# EAGLE schematic CAN2matrix (EAGLE 6.1)
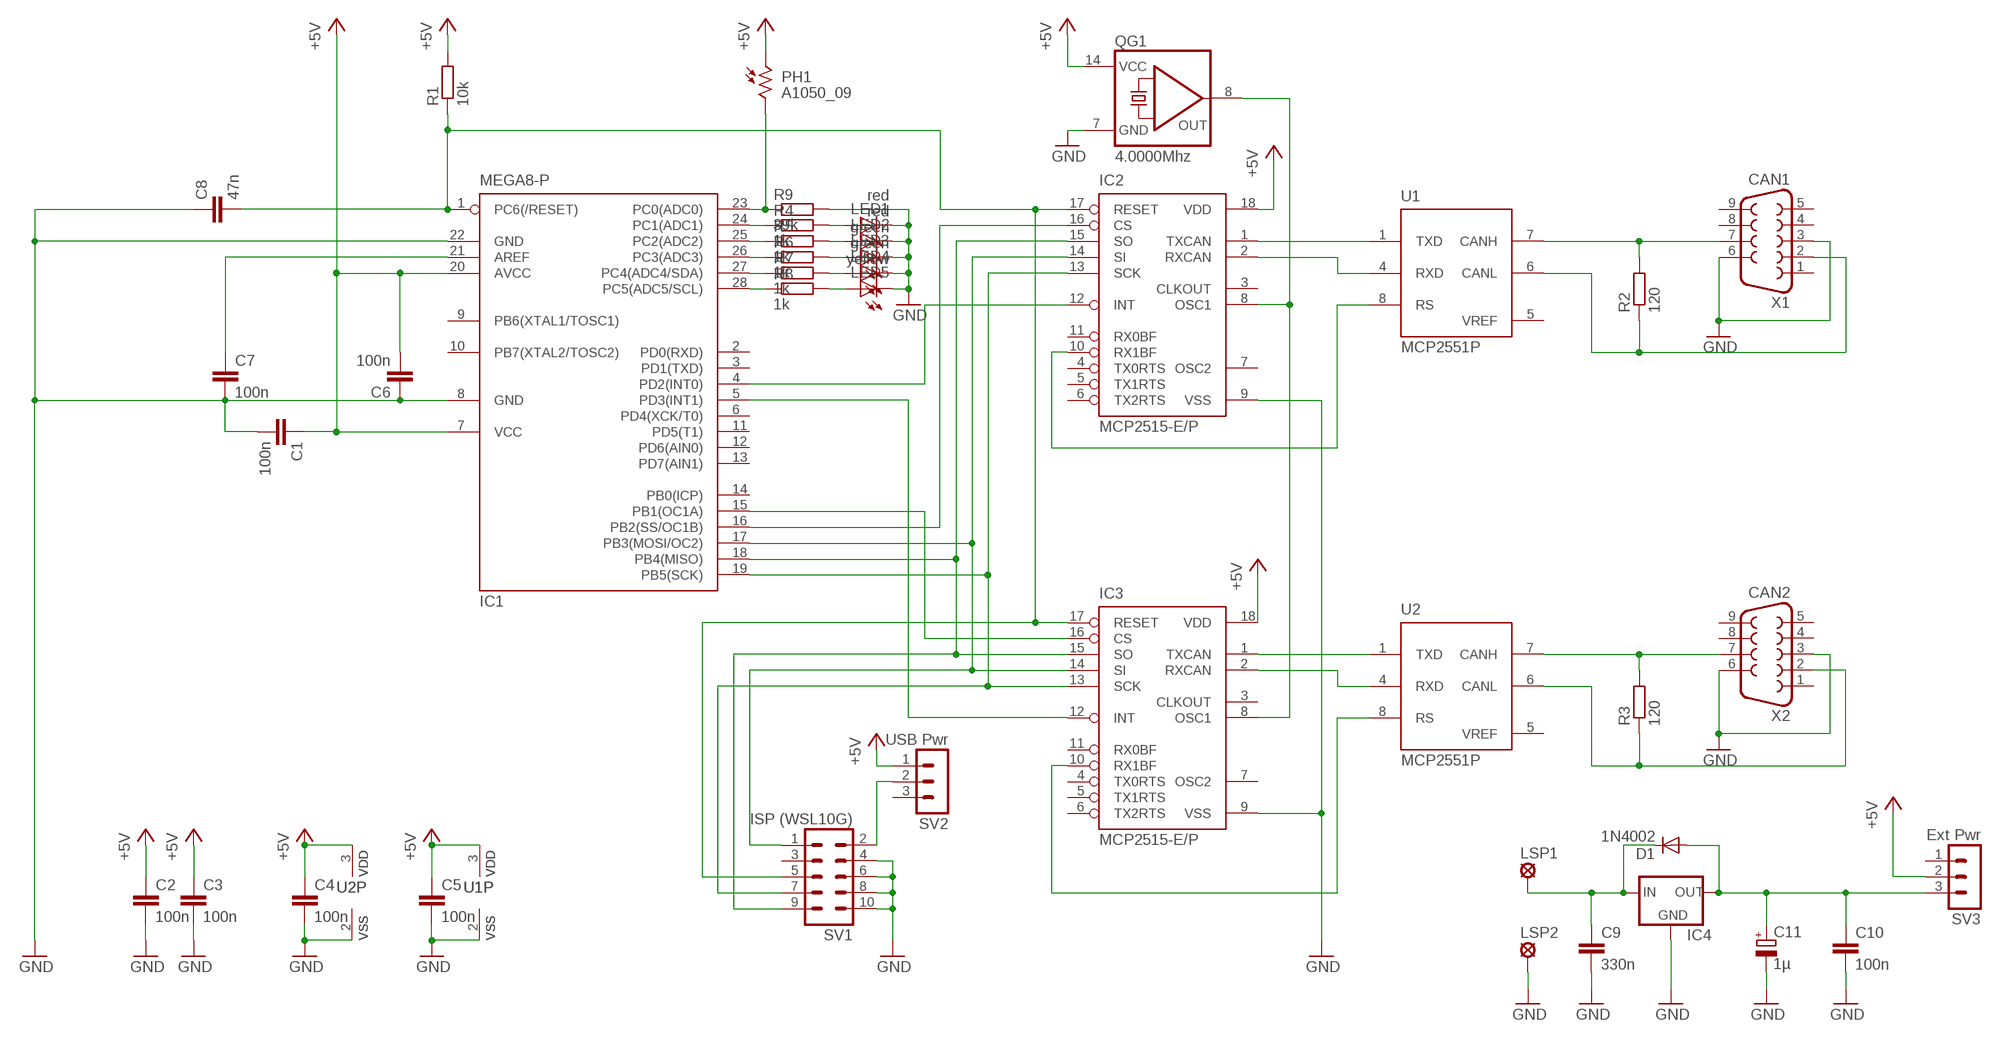
[diagram p0: schematic, sheet 1]

## Parts
C1  100n  C-EU050-025X075  [C050-025X075]
C2  100n  C-EU050-025X075  [C050-025X075]
C3  100n  C-EU050-025X075  [C050-025X075]
C4  100n  C-EU050-025X075  [C050-025X075]
C5  100n  C-EU050-025X075  [C050-025X075]
C6  100n  C-EU050-025X075  [C050-025X075]
C7  100n  C-EU050-025X075  [C050-025X075]
C8  47n  C-EU050-025X075  [C050-025X075]
C9  330n  C-EU050-025X075  [C050-025X075]
C10  100n  C-EU050-025X075  [C050-025X075]
C11  1µ  CPOL-EUE2.5-7  [E2,5-7]
D1  1N4002  1N4004  [DO41-10]
IC1  MEGA8-P  [DIL28-3]
IC2  MCP2515-E/P  [DIL18]
IC3  MCP2515-E/P  [DIL18]
IC4  78LXX  [78LXX]
LED1  red  LED3MM  [LED3MM]
LED2  red  LED3MM  [LED3MM]
LED3  green  LED3MM  [LED3MM]
LED4  green  LED3MM  [LED3MM]
LED5  yellow  LED3MM  [LED3MM]
LSP1  +12V  SE14  [SE14]
LSP2  SE14  [SE14]
PH1  A1050_09  [T0-46-A10XX]
QG1  4.0000Mhz  QG5860  [DIL14S]
R1  10k  R-EU_0207/2V  [0207/2V]
R2  120  R-EU_0207/2V  [0207/2V]
R3  120  R-EU_0207/2V  [0207/2V]
R4  1k  R-EU_0207/10  [0207/10]
R5  1k  R-EU_0207/10  [0207/10]
R6  1k  R-EU_0207/10  [0207/10]
R7  1k  R-EU_0207/10  [0207/10]
R8  1k  R-EU_0207/10  [0207/10]
R9  39k  R-EU_0204/7  [0204/7]
SV1  ISP (WSL10G)  ML10  [ML10]
SV2  USB Pwr  MA03-1  [MA03-1]
SV3  Ext Pwr  MA03-1  [MA03-1]
U1  MCP2551P  [DIL8]
U2  MCP2551P  [DIL8]
X1  CAN1  F09HP  [F09HP]
X2  CAN2  F09HP  [F09HP]

## Nets
+5V: C1.1 C2.1 C3.1 C4.1 C5.1 C6.2 IC1.7(VCC) IC1.20(AVCC) IC2.18(VDD) IC3.18(VDD) PH1.1 QG1.14(VCC) R1.2 SV2.1 SV3.2 U1.3(VDD) U2.3(VDD)
+12V: C9.1 D1.C IC4.IN LSP1.MP
GND: C1.2 C2.2 C3.2 C4.2 C5.2 C6.1 C7.2 C8.1 C9.2 C10.2 C11.- IC1.8(GND) IC1.22(GND) IC2.9(VSS) IC3.9(VSS) IC4.GND LED1.K(C) LED2.K(C) LED3.K(C) LED4.K(C) LED5.K(C) LSP2.MP QG1.7(GND) R9.2 SV1.4 SV1.6 SV1.8 SV1.10 U1.2(VSS) U2.2(VSS) X1.3 X1.6 X2.3 X2.6
N$1: IC1.18(PB4(MISO)) IC2.15(SO) IC3.15(SO) SV1.9
N$2: IC1.17(PB3(MOSI/OC2)) IC2.14(SI) IC3.14(SI) SV1.1
N$3: IC1.19(PB5(SCK)) IC2.13(SCK) IC3.13(SCK) SV1.7
N$4: R2.2 U1.7(CANH) X1.7
N$5: R3.2 U2.7(CANH) X2.7
N$6: R3.1 U2.6(CANL) X2.2
N$7: IC3.10(RX1BF) U2.8(RS)
N$8: C7.1 IC1.21(AREF)
N$9: C8.2 IC1.1(PC6(/RESET)) IC2.17(RESET) IC3.17(RESET) R1.1 SV1.5
N$10: IC2.1(TXCAN) U1.1(TXD)
N$11: IC2.2(RXCAN) U1.4(RXD)
N$12: IC3.1(TXCAN) U2.1(TXD)
N$13: IC3.2(RXCAN) U2.4(RXD)
N$14: IC1.16(PB2(SS/OC1B)) IC2.16(CS)
N$15: IC1.15(PB1(OC1A)) IC3.16(CS)
N$16: IC1.4(PD2(INT0)) IC2.12(INT)
N$17: IC1.5(PD3(INT1)) IC3.12(INT)
N$18: IC2.8(OSC1) IC3.8(OSC1) QG1.8(OUT)
N$19: IC2.10(RX1BF) U1.8(RS)
N$20: R2.1 U1.6(CANL) X1.2
N$21: SV1.2 SV2.2
N$22: IC1.24(PC1(ADC1)) R4.1
N$23: IC1.25(PC2(ADC2)) R5.1
N$24: IC1.26(PC3(ADC3)) R6.1
N$25: IC1.27(PC4(ADC4/SDA)) R7.1
N$26: IC1.28(PC5(ADC5/SCL)) R8.1
N$27: LED1.A R4.2
N$28: LED2.A R5.2
N$29: LED3.A R6.2
N$30: LED4.A R7.2
N$31: LED5.A R8.2
N$32: IC1.23(PC0(ADC0)) PH1.2 R9.1
N$33: C10.1 C11.+ D1.A IC4.OUT SV3.3
Unconnected: IC1.2(PD0(RXD)) IC1.3(PD1(TXD)) IC1.6(PD4(XCK/T0)) IC1.9(PB6(XTAL1/TOSC1)) IC1.10(PB7(XTAL2/TOSC2)) IC1.11(PD5(T1)) IC1.12(PD6(AIN0)) IC1.13(PD7(AIN1)) IC1.14(PB0(ICP)) IC2.3(CLKOUT) IC2.4(TX0RTS) IC2.5(TX1RTS) IC2.6(TX2RTS) IC2.7(OSC2) IC2.11(RX0BF) IC3.3(CLKOUT) IC3.4(TX0RTS) IC3.5(TX1RTS) IC3.6(TX2RTS) IC3.7(OSC2) IC3.11(RX0BF) SV1.3 SV2.3 SV3.1 X1.1 X1.4 X1.5 X1.8 X1.9 X2.1 X2.4 X2.5 X2.8 X2.9

## Power pins joined to a net without a drawn wire
VREF: U1.5(VREF) U2.5(VREF)

## Library data of the parts
C1-C10 = resistor:C-EU: CAPACITOR, European symbol
C11 = resistor:CPOL-EU: POLARIZED CAPACITOR, European symbol
D1 = diode:1N4004: DIODE general purpose rectifier, 1 A
IC1 = atmel:MEGA8-P: MICROCONTROLLER 8 Kbytes FLASH, 1 kbytes SRAM, 512 bytes EEPROM, USART, 4-channel 10 bit ADC, 2-channel 8 bit ADC Pin compatible with Atmega48, ATMega88, ATMega168 Source: avr.lbr; OC_FARNELL: unknown; OC_NEWARK: unknown
IC2 IC3 = mcp2515:MCP2515
IC4 = v-reg:78LXX: VOLTAGE REGULATOR
LED1-LED5 = led:LED: LED OSRAM: - CHIPLED LG R971, LG N971, LY N971, LG Q971, LY Q971, LO R971, LY R971 LH N974, LH R974 LS Q976, LO Q976, LY Q976 LO Q996 - Hyper CHIPLED LW Q18S LB Q993, LB Q99A, LB R99A - SideLED LS A670, LO A670, LY A670, LG A670, LP A670 LB A673, LV A673, LT A673, LW A673 LH A674 LY A675 LS A676, LA A676, LO A676, LY A676, LW A676 LS A679, LY A679, LG A679 - Hyper Micro SIDELED® LS Y876, LA Y876, LO Y876, LY Y876 LT Y87S - SmartLED LW L88C, LW L88S LB L89C, LB L89S, LG L890 LS L89K, LO L89K, LY L89K LS L896, LA L896, LO L896, LY L896 - TOPLED LS T670, LO T670, LY T670, LG T670, LP T670 LSG T670, LSP T670, LSY T670, LOP T670, LYG T670 LG T671, LOG T671, LSG T671 LB T673, LV T673, LT T673, LW T673 LH T674 LS T676, LA T676, LO T676, LY T676, LB T676, LH T676, LSB T676, LW T676 LB T67C, LV T67C, LT T67C, LS T67K, LO T67K, LY T67K, LW E67C LS E67B, LA E67B, LO E67B, LY E67B, LB E67C, LV E67C, LT E67C LW T67C LS T679, LY T679, LG T679 LS T770, LO T770, LY T770, LG T770, LP T770 LB T773, LV T773, LT T773, LW T773 LH T774 LS E675, LA E675, LY E675, LS T675 LS T776, LA T776, LO T776, LY T776, LB T776 LHGB T686 LT T68C, LB T68C - Hyper Mini TOPLED® LB M676 - Mini TOPLED Santana® LG M470 LS M47K, LO M47K, LY M47K Source: http://www.osram.convergy.de LUXEON: - LUMILED® LXK2-PW12-R00, LXK2-PW12-S00, LXK2-PW14-U00, LXK2-PW14-V00 LXK2-PM12-R00, LXK2-PM12-S00, LXK2-PM14-U00 LXK2-PE12-Q00, LXK2-PE12-R00, LXK2-PE12-S00, LXK2-PE14-T00, LXK2-PE14-U00 LXK2-PB12-K00, LXK2-PB12-L00, LXK2-PB12-M00, LXK2-PB14-N00, LXK2-PB14-P00, LXK2-PB14-Q00 LXK2-PR12-L00, LXK2-PR12-M00, LXK2-PR14-Q00, LXK2-PR14-R00 LXK2-PD12-Q00, LXK2-PD12-R00, LXK2-PD12-S00 LXK2-PH12-R00, LXK2-PH12-S00 LXK2-PL12-P00, LXK2-PL12-Q00, LXK2-PL12-R00 Source: www.luxeon.com KINGBRIGHT: KA-3528ASYC Source: www.kingbright.com
LSP1 LSP2 = solpad:SE14: SOLDER PAD E1553, drill 1,4mm, distributor Buerklin, 07F820
PH1 = photo-elements:A10: Sensor Robust Light Sensing Applications Outdoor Light Sensing Application Source: http://optoelectronics.perkinelmer.com/content/Datasheets/DTS_PhotocellsA1050.pdf
QG1 = crystal:QG5860: CRYSTAL RESONATOR; OC_FARNELL: unknown; OC_NEWARK: unknown
R1-R9 = resistor:R-EU_: RESISTOR, European symbol
SV1 = con-ml:ML10: HARTING; OC_FARNELL: unknown; OC_NEWARK: unknown
SV2 SV3 = con-lstb:MA03-1: PIN HEADER; OC_FARNELL: unknown; OC_NEWARK: unknown
U1 U2 = microchip_can:MCP2551: High Speed CAN tranceiver
X1 X2 = con-subd:F09: SUB-D; OC_FARNELL: unknown; OC_NEWARK: unknown